# EAGLE design resistor_test (EAGLE 7.6.0)
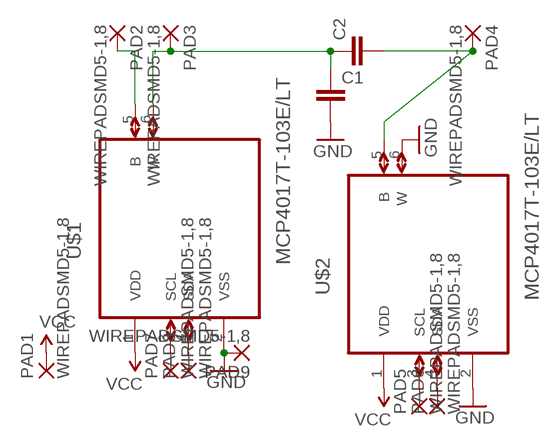
[diagram p0: schematic, sheet 1]

## Parts
C1  C-EUC0603  [C0603]
C2  C-EUC0603  [C0603]
PAD1  WIREPADSMD5-1,8  [5-1,8]
PAD2  WIREPADSMD5-1,8  [5-1,8]
PAD3  WIREPADSMD5-1,8  [5-1,8]
PAD4  WIREPADSMD5-1,8  [5-1,8]
PAD5  WIREPADSMD5-1,8  [5-1,8]
PAD6  WIREPADSMD5-1,8  [5-1,8]
PAD7  WIREPADSMD5-1,8  [5-1,8]
PAD8  WIREPADSMD5-1,8  [5-1,8]
PAD9  WIREPADSMD5-1,8  [5-1,8]
U$1  MCP4017T-103E/LT  [SOT65P210X110-6N]
U$2  MCP4017T-103E/LT  [SOT65P210X110-6N]

## Nets
GND: C1.2 PAD9.1(P) U$1.2(VSS) U$2.2(VSS) U$2.6(W)
N$1: PAD5.1(P) U$2.3(SCL)
N$2: PAD6.1(P) U$2.4(SDA)
N$3: PAD7.1(P) U$1.3(SCL)
N$4: PAD8.1(P) U$1.4(SDA)
N$5: C1.1 C2.1 PAD3.1(P) U$1.6(W)
N$6: C2.2 PAD4.1(P) U$2.5(B)
N$8: PAD2.1(P) U$1.5(B)
VCC: PAD1.1(P) U$1.1(VDD) U$2.1(VDD)

## Library data of the parts
C1 C2 = rcl:C-EU: CAPACITOR, European symbol
PAD1-PAD9 = wirepad:WIREPAD: Wire PAD connect wire on PCB
U$1 U$2 = MCP4017T-103E_LT:MCP4017T-103E/LT: Digital POT; AVAILABILITY: Good; DESCRIPTION: MCP4017 Series Single 7-Bit 128 Step I2C 10 kOhm Volatile Digital POT - SC-70-6; MF: Microchip; MP: MCP4017T-103E/LT; PACKAGE: SC-70 Microchip; PRICE: 0.46 USD

## Net classes
0 default: width 0.406 mm

## Board
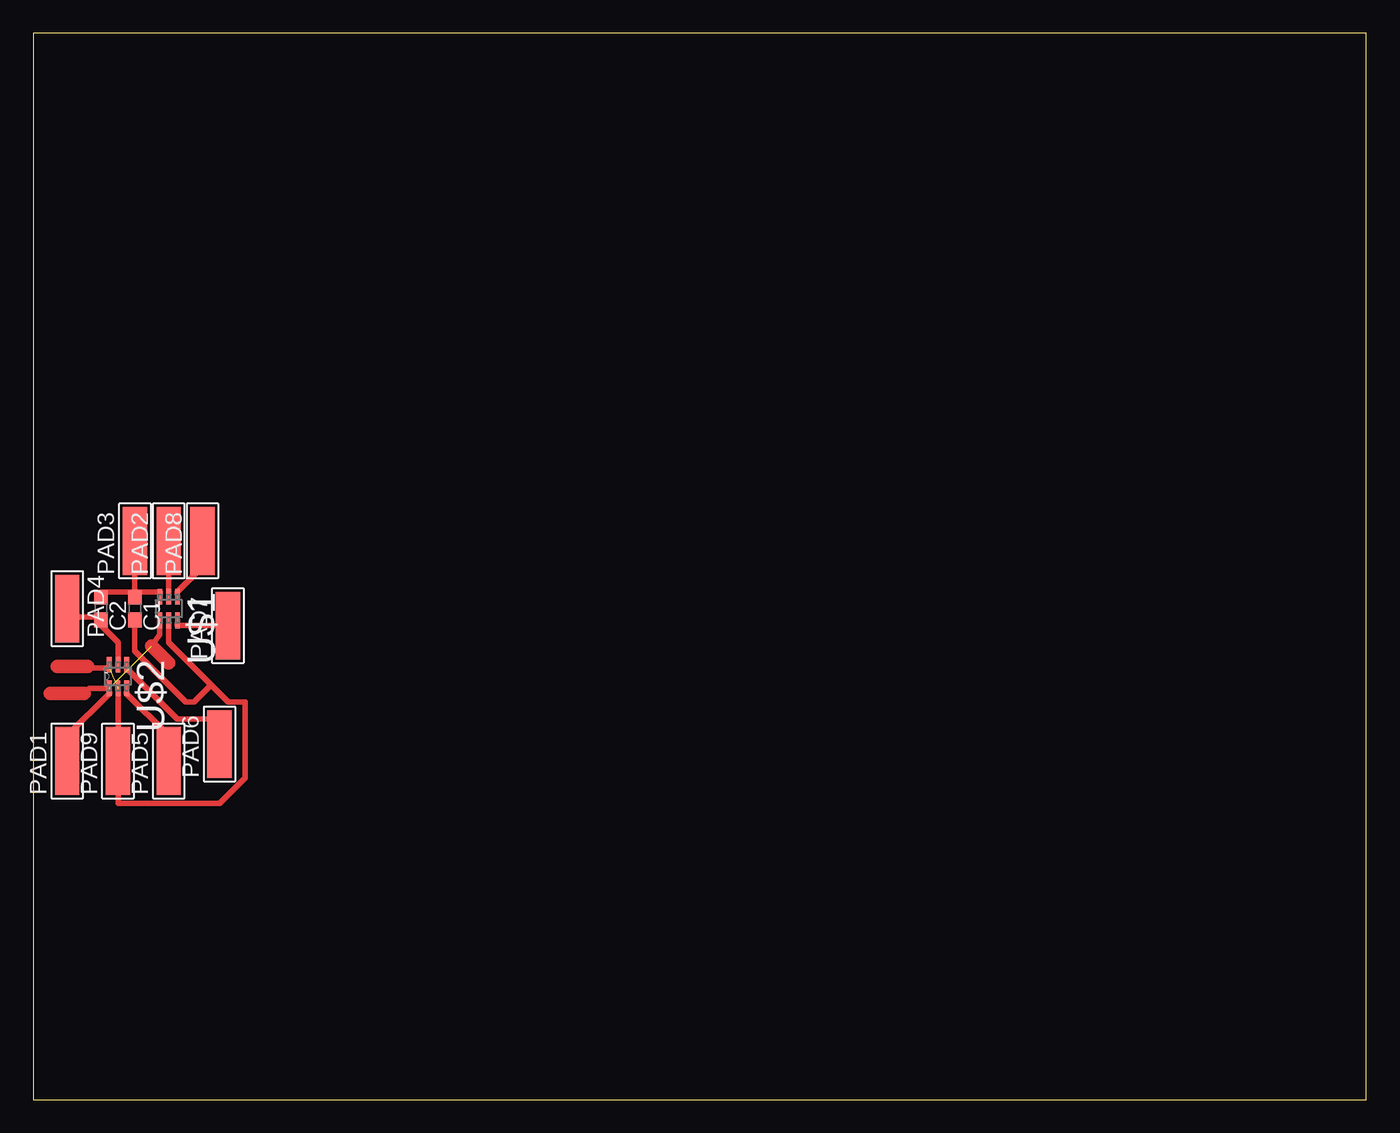
[diagram p1: board, top side]

Size 100 x 80 mm. Coordinates in mm from the lower left corner, seen from the top.
Outline: 0,0 100,0 100,80 0,80 0,0
Copper layers (1*16): Top 0.035mm / dielectric 1.5mm / Bottom 0.035mm
Design rules "default": minimum track width 10mil, minimum drill 24mil, track to track 8mil, track to pad 8mil, pad to pad 8mil, via to via 8mil, smd to smd 8mil, copper to edge 40mil, drill to drill 8mil, minimum pad ring 10mil, minimum via ring 8mil, stop-mask expansion 4mil, vias tented up to drill 0mil, thermal gap 10mil

### Footprints (pad centres in the part's own frame; a part is rotated, then mirrored left to right if it is on the bottom)
C0603 = smd 1.1 x 1: 1 -0.85,0; 2 0.85,0
5-1,8 = smd 1.829 x 5.08: 1 0,0
SOT65P210X110-6N = smd 1.168 x 0.356: 1 -0.889,0.66; 2 -0.889,0; 3 -0.889,-0.66; 4 0.889,-0.66; 5 0.889,0; 6 0.889,0.66

### Placement (x,y rotation side)
C1  7.62,36.83 270 top
C2  5.08,36.83 270 top
PAD1  2.54,25.4 0 top
PAD2  10.16,41.91 0 top
PAD3  7.62,41.91 0 top
PAD4  2.54,36.83 180 top
PAD5  10.16,25.4 0 top
PAD6  13.97,26.67 0 top
PAD7  14.61,35.56 0 top
PAD8  12.7,41.91 0 top
PAD9  6.35,25.4 0 top
U$1  10.16,36.83 90 top
U$2  6.35,31.75 90 top

### Tracks (layer width: path | path; a pad name or v marks a point on that pad's centre or on a via)
GND  (1 unrouted)
  Top 0.406: U$1.2 10.16,34.29 13.34,31.11 | U$2.2 PAD9.1 6.35,22.23 13.97,22.23 15.88,24.13 15.88,29.84 14.61,29.84 13.34,31.11 | U$2.6 5.71,32.38 4.19,32.38 4.06,32.51 | C1.2 7.62,33.66 11.43,29.84 12.06,29.84 13.34,31.11
  Top 1.016: 4.06,32.51 1.78,32.51
N$1
  Top 0.406: PAD5.1 10.16,27.3 6.99,30.48 U$2.3
N$2
  Top 0.406: PAD6.1 13.97,28.57 10.79,28.57 6.99,32.38 U$2.4
N$3
  Top 0.406: PAD7.1 10.79,35.56 U$1.3
N$4
  Top 0.406: PAD8.1 12.7,40.01 10.79,38.1 U$1.4
N$5
  Top 0.406: 7.62,38.1 5.08,38.1 C2.1 | 7.62,38.1 9.53,38.1 U$1.6 | PAD3.1 7.62,38.1 | 7.62,38.1 C1.1
N$6
  Top 0.406: U$2.5 6.35,34.29 5.08,35.56 C2.2 5.08,36.2 2.54,36.2 PAD4.1
N$8
  Top 0.406: PAD2.1 U$1.5
VCC  (1 unrouted)
  Top 0.406: PAD1.1 2.54,27.3 5.71,30.48 U$2.1 4.19,30.86 3.81,30.48 | U$1.1 9.5,34.9 8.89,34.04
  Top 1.016: 8.89,34.04 10.16,32.77 | 3.81,30.48 1.27,30.48